# Altium schematic sheet payload_detect.SchDoc
size 558 x 431 mm; SheetNumber: 2; SheetTotal: 4
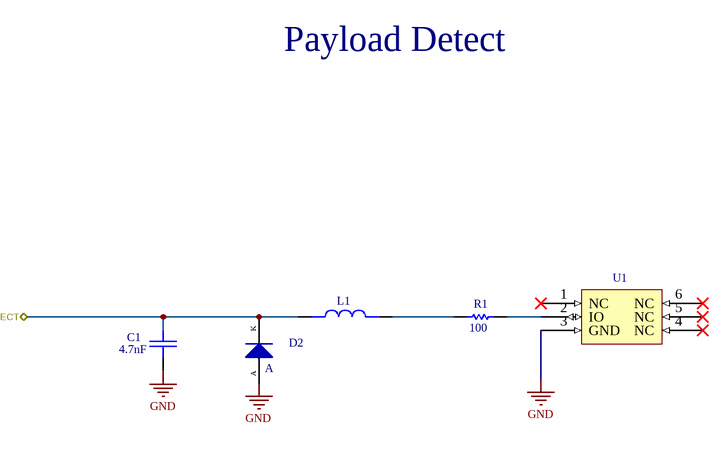
[diagram p0: payload_detect.SchDoc]

## Parts
C1  value 4.7nF  [CAP-0402-A]  (hidden comment: CAP 0402 4700PF 50V 10% X7R)
D2  A  [DI-SOD123F-A]
L1  MDF2016BSS270C  [IND-0806-A]  (value not drawn)
R1  value 100  [RES-0402-B]  (hidden comment: Res 0402 100 Ohm 0.1W 1% Thick Film)
U1  DS2431Q-TR  [IC-TDFN3X3-B]  (value not drawn)

## Ports
DETECT (bidir)

## Nets
GND: C1.1 U1.3(GND)
DETECT: C1.2 D2.K L1.1 ; port DETECT
NetL1_2: L1.2 R1.1
NetR1_2: R1.2 U1.2(IO)

Not connected (* = marked no-connect by the designer): D2 A; U1 1(NC)* 4(NC)* 5(NC)* 6(NC)*

## Notes on the sheet
- Payload Detect
- Labels drawn without touching a wire or pin: GND
- REVISIONS
- REVISION
- DESCRIPTION
- DATE(YEAR-MO-DA)
- APPROVED
- DWG NO
- SH
- THIS DRAWING IS CAD MAINTAINED.
  CHANGES SHALL BE INCORPORATED
  BY THE DESIGN ACTIVITY.
- PART NO.
- CONTRACT NUMBER
- DESIGN ACTIVITY
- CONTRACTOR
- US ARMY
  COMBAT CAPABILITIES DEVELOPMENT COMMAND ARMAMENTS CENTER
  PICATINNY ARSENAL, NEW JERSEY 07806-5000
- DRAWN BY
- ENGINEER
- CHECKER
- QUALITY ENGINEER
- DRAWING APPROVAL
- SIZE
- CAGE CODE
- DWG NO.
- NEXT ASSY
- USED ON
- DESIGN APPROVAL
- C
- 19200
- APPLICATION
- SCALE
- NONE
- UNIT WT.
- ---
- SHEET

## Library data of the parts
C1 = CAP-00371-1: Leader Qty: 100; UOM: EA; Case/Package: 0402; Max Operating Temperature: 150°C; Min Operating Temperature: -55°C; Mounting Technology: Surface Mount
D2 = CMP-004-00132-1: TVS Diodes & ESD Suppressors; P4FL3.3A_R1_00001; PANJIT; 3.3 V; 5.2 V; Polarity: Unidirectional; Case/Package: SOD123FL; Max Operating Temperature: 150°C; Min Operating Temperature: -55°C; Mounting Technology: SMT
L1 = CMP-00660-4: Ferrite Bead, Aec-Q200, 0806, 1A Rohs Compliant: Yes; Manufacturer Lifecycle Status: PRODUCTION; DC Resistance (DCR): 220mΩ; Impedance: 27Ω; Number of Circuits: 1; Current Rating: 1A; Export Control Classification Number (ECCN) Code: EAR99; Harmonized Tariff Schedule (HTS) Code: 8504.50.80.00; Height: 1mm; Introduction Date: 2021-03-10; Length: 2mm; Lifecycle Status: Production; Max Length: 2.2mm; Max Operating Temperature: 125°C; Max Width: 1.8mm; Min Length: 1.8mm; Min Operating Temperature: -40°C; Min Width: 1.4mm; Number of Terminals: 2; REACH SVHC: Yes; RoHS: Compliant; Width: 1.6mm
R1 = RES-00021-9: Voltage Rating: 100V; Case/Package: 0402; Leader Qty: 100; Max Operating Temperature: 155°C; Min Operating Temperature: -55°C; Mounting Technology: SMD; Pins: 2
U1 = IC-00419-6: IC EEPROM 1KBIT 1-WIRE 6TDFN; Manufacturer Lifecycle Status: PRODUCTION; Density: 1kb; Interface: Serial; Max Supply Voltage: 5.25V; Memory Size: 128B; Min Supply Voltage: 2.8V; Contact Plating: Tin; Lifecycle Status: Production; Max Operating Temperature: 85°C; Memory Format: EEPROM; Min Operating Temperature: -40°C; Pins: 6; Radiation Hardening: No; REACH SVHC: Unknown; RoHS: Compliant; Schedule B: 8542320050